# EAGLE design strip (EAGLE 6.2)

## Sheet 1 of 2
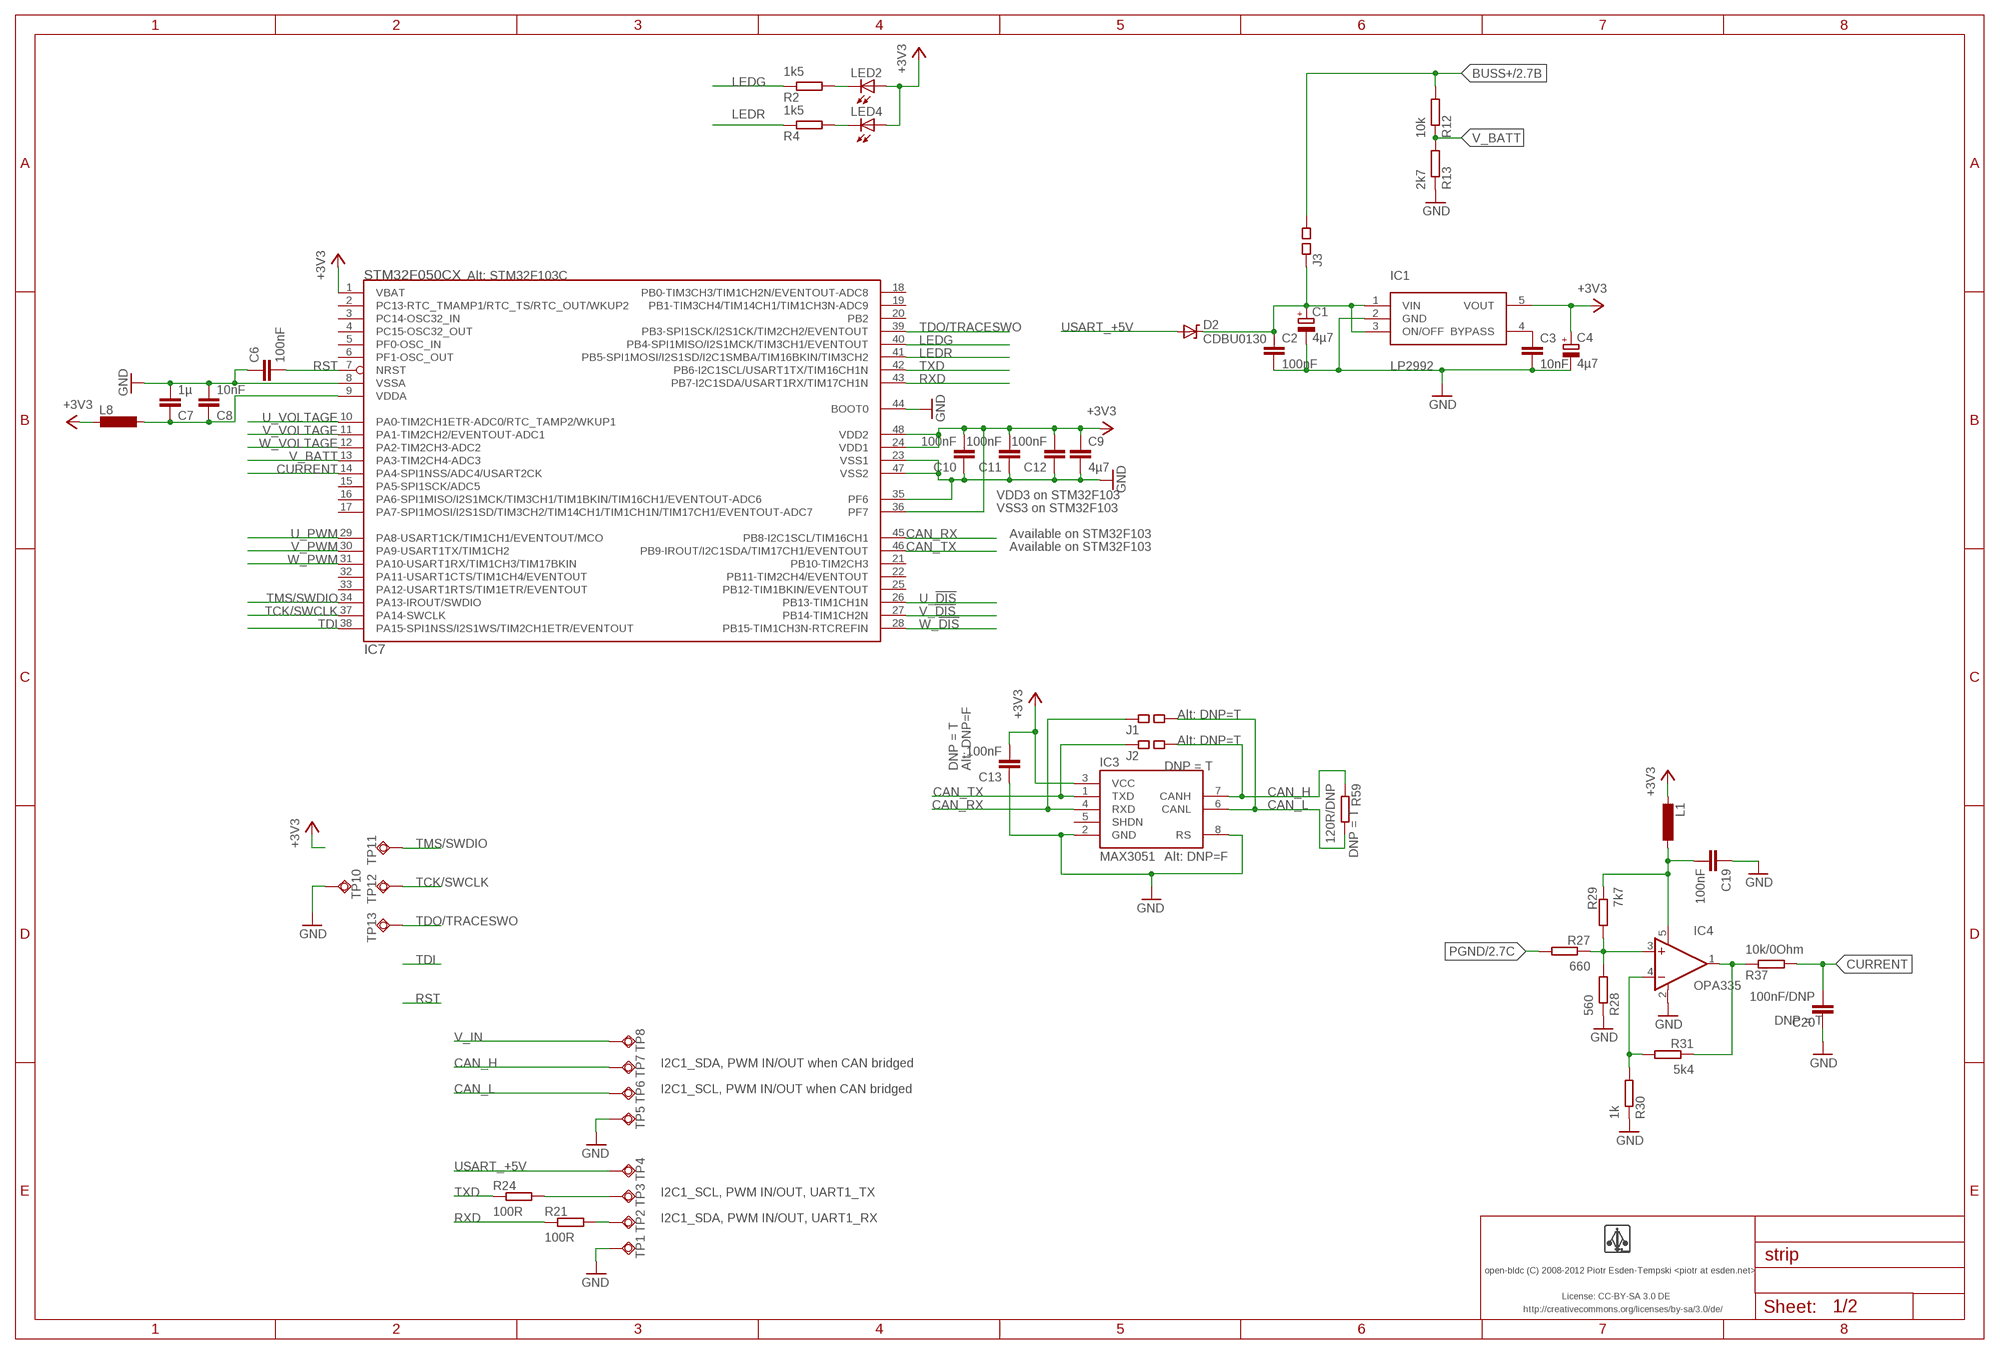
[diagram p0: schematic, sheet 1]

### Parts
C1  4µ7  CAPACITOR-POL-0805  [0805-POL-CAP]
C2  100nF  CAPACITOR-0402  [0402-CAP]
C3  10nF  CAPACITOR-0402  [0402-CAP]
C4  4µ7  CAPACITOR-POL-0805  [0805-POL-CAP]
C6  100nF  CAPACITOR-0402  [0402-CAP]
C7  1µ  CAPACITOR-0402  [0402-CAP]
C8  10nF  CAPACITOR-0402  [0402-CAP]
C9  4µ7  CAPACITOR-0805  [0805-CAP]
C10  100nF  CAPACITOR-0402  [0402-CAP]
C11  100nF  CAPACITOR-0402  [0402-CAP]
C12  100nF  CAPACITOR-0402  [0402-CAP]
C13  100nF  CAPACITOR-0402  [0402-CAP]
C19  100nF  CAPACITOR-0402  [0402-CAP]
C20  100nF/DNP  CAPACITOR-0402  [0402-CAP]
D2  CDBU0130  DIODE-ZENER-0603  [0603-DIO]
IC1  LP2992  [SOT23-5]
IC3  MAX3051  [SO8]
IC4  OPA335  [SOT23-5]
IC7  STM32F050CX  [LQFP48]
J1  SQ_JMP-0402  [0402-SQJMP]
J2  SQ_JMP-0402  [0402-SQJMP]
J3  SQ_JMP-0402  [0402-SQJMP]
L1  INDUCTOR-0603  [0603-IND]
L8  INDUCTOR-0603  [0603-IND]
LED2  GREEN  LED-0402  [0402-LED]
LED4  RED  LED-0402  [0402-LED]
R2  1k5  RESISTOR-0402  [0402-RES]
R4  1k5  RESISTOR-0402  [0402-RES]
R12  10k  RESISTOR-0402  [0402-RES]
R13  2k7  RESISTOR-0402  [0402-RES]
R21  100R  RESISTOR-0402  [0402-RES]
R24  100R  RESISTOR-0402  [0402-RES]
R27  660  RESISTOR-0402  [0402-RES]
R28  560  RESISTOR-0402  [0402-RES]
R29  7k7  RESISTOR-0402  [0402-RES]
R30  1k  RESISTOR-0402  [0402-RES]
R31  5k4  RESISTOR-0402  [0402-RES]
R37  10k/0Ohm  RESISTOR-0402  [0402-RES]
R59  120R/DNP  RESISTOR-0402  [0402-RES]
TP1  TPSQTP20SQ  [TP20SQ]
TP2  TPSQTP20SQ  [TP20SQ]
TP3  TPSQTP20SQ  [TP20SQ]
TP4  TPSQTP20SQ  [TP20SQ]
TP5  TPSQTP20SQ  [TP20SQ]
TP6  TPSQTP20SQ  [TP20SQ]
TP7  TPSQTP20SQ  [TP20SQ]
TP8  TPSQTP20SQ  [TP20SQ]
TP10  TPSQTP11SQ  [TP11SQ]
TP11  TPSQTP11SQ  [TP11SQ]
TP12  TPSQTP11SQ  [TP11SQ]
TP13  TPSQTP11SQ  [TP11SQ]
U$1  LOGO  LOGO-SILK-SMALL  [LOGO_SILK_SMALL]

### Nets
+3V3: C4.+ C9.P$1 C10.P$2 C11.P$2 C12.P$2 C13.P$2 IC1.5(VOUT) IC3.3(VCC) IC7.1(VBAT) IC7.24(VDD1) IC7.36(PF7) IC7.48(VDD2) L1.P$2 L8.P$2 LED2.A LED4.A
BUSS+: J3.P$2 R12.P$2 ; also sheet 2
CAN_H: IC3.7(CANH) J2.P$2 R59.P$1 TP7.TP
CAN_L: IC3.6(CANL) J1.P$2 R59.P$2 TP6.TP
CAN_RX: IC3.4(RXD) IC7.45(PB8-I2C1SCL/TIM16CH1) J1.P$1
CAN_TX: IC3.1(TXD) IC7.46(PB9-IROUT/I2C1SDA/TIM17CH1/EVENTOUT) J2.P$1
CURRENT: C20.P$2 IC7.14(PA4-SPI1NSS/ADC4/USART2CK) R37.P$2
CURRENT_RAW: IC4.1(OUT) R31.P$1 R37.P$1
GND: C1.- C2.P$2 C3.P$2 C4.- C6.P$1 C7.P$2 C8.P$2 C9.P$2 C10.P$1 C11.P$1 C12.P$1 C13.P$1 C19.P$1 C20.P$1 IC1.2(GND) IC3.2(GND) IC3.8(RS) IC4.2(V-) IC7.8(VSSA) IC7.23(VSS1) IC7.35(PF6) IC7.44(BOOT0) IC7.47(VSS2) R13.P$1 R28.P$1 R30.P$1 TP1.TP TP5.TP TP10.TP ; also sheet 2
LEDG: IC7.40(PB4-SPI1MISO/I2S1MCK/TIM3CH1/EVENTOUT) R2.P$1
LEDR: IC7.41(PB5-SPI1MOSI/I2S1SD/I2C1SMBA/TIM16BKIN/TIM3CH2) R4.P$1
N$4: LED4.C R4.P$2
N$6: R21.P$2 TP2.TP
N$9: C19.P$2 IC4.5(V+) L1.P$1 R29.P$1
N$10: LED2.C R2.P$2
N$11: IC4.3(+IN) R27.P$1 R28.P$2 R29.P$2
N$12: IC4.4(-IN) R30.P$2 R31.P$2
N$20: R24.P$2 TP3.TP
N$22: C3.P$1 IC1.4(BYPASS)
PGND: R27.P$2 ; also sheet 2
RST: C6.P$2 IC7.7(NRST)
RXD: IC7.43(PB7-I2C1SDA/USART1RX/TIM17CH1N) R21.P$1
TCK/SWCLK: IC7.37(PA14-SWCLK) TP12.TP
TDI: IC7.38(PA15-SPI1NSS/I2S1WS/TIM2CH1ETR/EVENTOUT)
TDO/TRACESWO: IC7.39(PB3-SPI1SCK/I2S1CK/TIM2CH2/EVENTOUT) TP13.TP
TMS/SWDIO: IC7.34(PA13-IROUT/SWDIO) TP11.TP
TXD: IC7.42(PB6-I2C1SCL/USART1TX/TIM16CH1N) R24.P$1
U_!DIS: IC7.26(PB13-TIM1CH1N) ; also sheet 2
U_PWM: IC7.29(PA8-USART1CK/TIM1CH1/EVENTOUT/MCO) ; also sheet 2
U_VOLTAGE: IC7.10(PA0-TIM2CH1ETR-ADC0/RTC_TAMP2/WKUP1) ; also sheet 2
USART_+5V: D2.A TP4.TP
V_!DIS: IC7.27(PB14-TIM1CH2N) ; also sheet 2
V_BATT: IC7.13(PA3-TIM2CH4-ADC3) R12.P$1 R13.P$2
V_IN: C1.+ C2.P$1 D2.C IC1.1(VIN) IC1.3(ON/OFF) J3.P$1 TP8.TP
V_PWM: IC7.30(PA9-USART1TX/TIM1CH2) ; also sheet 2
V_VOLTAGE: IC7.11(PA1-TIM2CH2/EVENTOUT-ADC1) ; also sheet 2
VDDA: C7.P$1 C8.P$1 IC7.9(VDDA) L8.P$1
W_!DIS: IC7.28(PB15-TIM1CH3N-RTCREFIN) ; also sheet 2
W_PWM: IC7.31(PA10-USART1RX/TIM1CH3/TIM17BKIN) ; also sheet 2
W_VOLTAGE: IC7.12(PA2-TIM2CH3-ADC2) ; also sheet 2
Unconnected: IC3.5(SHDN) IC7.2(PC13-RTC_TMAMP1/RTC_TS/RTC_OUT/WKUP2) IC7.3(PC14-OSC32_IN) IC7.4(PC15-OSC32_OUT) IC7.5(PF0-OSC_IN) IC7.6(PF1-OSC_OUT) IC7.15(PA5-SPI1SCK/ADC5) IC7.16(PA6-SPI1MISO/I2S1MCK/TIM3CH1/TIM1BKIN/TIM16CH1/EVENTOUT-ADC6) IC7.17(PA7-SPI1MOSI/I2S1SD/TIM3CH2/TIM14CH1/TIM1CH1N/TIM17CH1/EVENTOUT-ADC7) IC7.18(PB0-TIM3CH3/TIM1CH2N/EVENTOUT-ADC8) IC7.19(PB1-TIM3CH4/TIM14CH1/TIM1CH3N-ADC9) IC7.20(PB2) IC7.21(PB10-TIM2CH3) IC7.22(PB11-TIM2CH4/EVENTOUT) IC7.25(PB12-TIM1BKIN/EVENTOUT) IC7.32(PA11-USART1CTS/TIM1CH4/EVENTOUT) IC7.33(PA12-USART1RTS/TIM1ETR/EVENTOUT)

### Notes on the sheet
- Alt: STM32F103C
- VDD3 on STM32F103
- VSS3 on STM32F103
- Available on STM32F103
- Available on STM32F103
- Alt: DNP=T
- Alt: DNP=T
- Alt: DNP=F
- Alt: DNP=F
- I2C1_SDA, PWM IN/OUT when CAN bridged
- I2C1_SCL, PWM IN/OUT when CAN bridged
- I2C1_SCL, PWM IN/OUT, UART1_TX
- I2C1_SDA, PWM IN/OUT, UART1_RX
- open-bldc (C) 2008-2012 Piotr Esden-Tempski <piotr at esden.net>
- License: CC-BY-SA 3.0 DE
- http://creativecommons.org/licenses/by-sa/3.0/de/

## Sheet 2 of 2
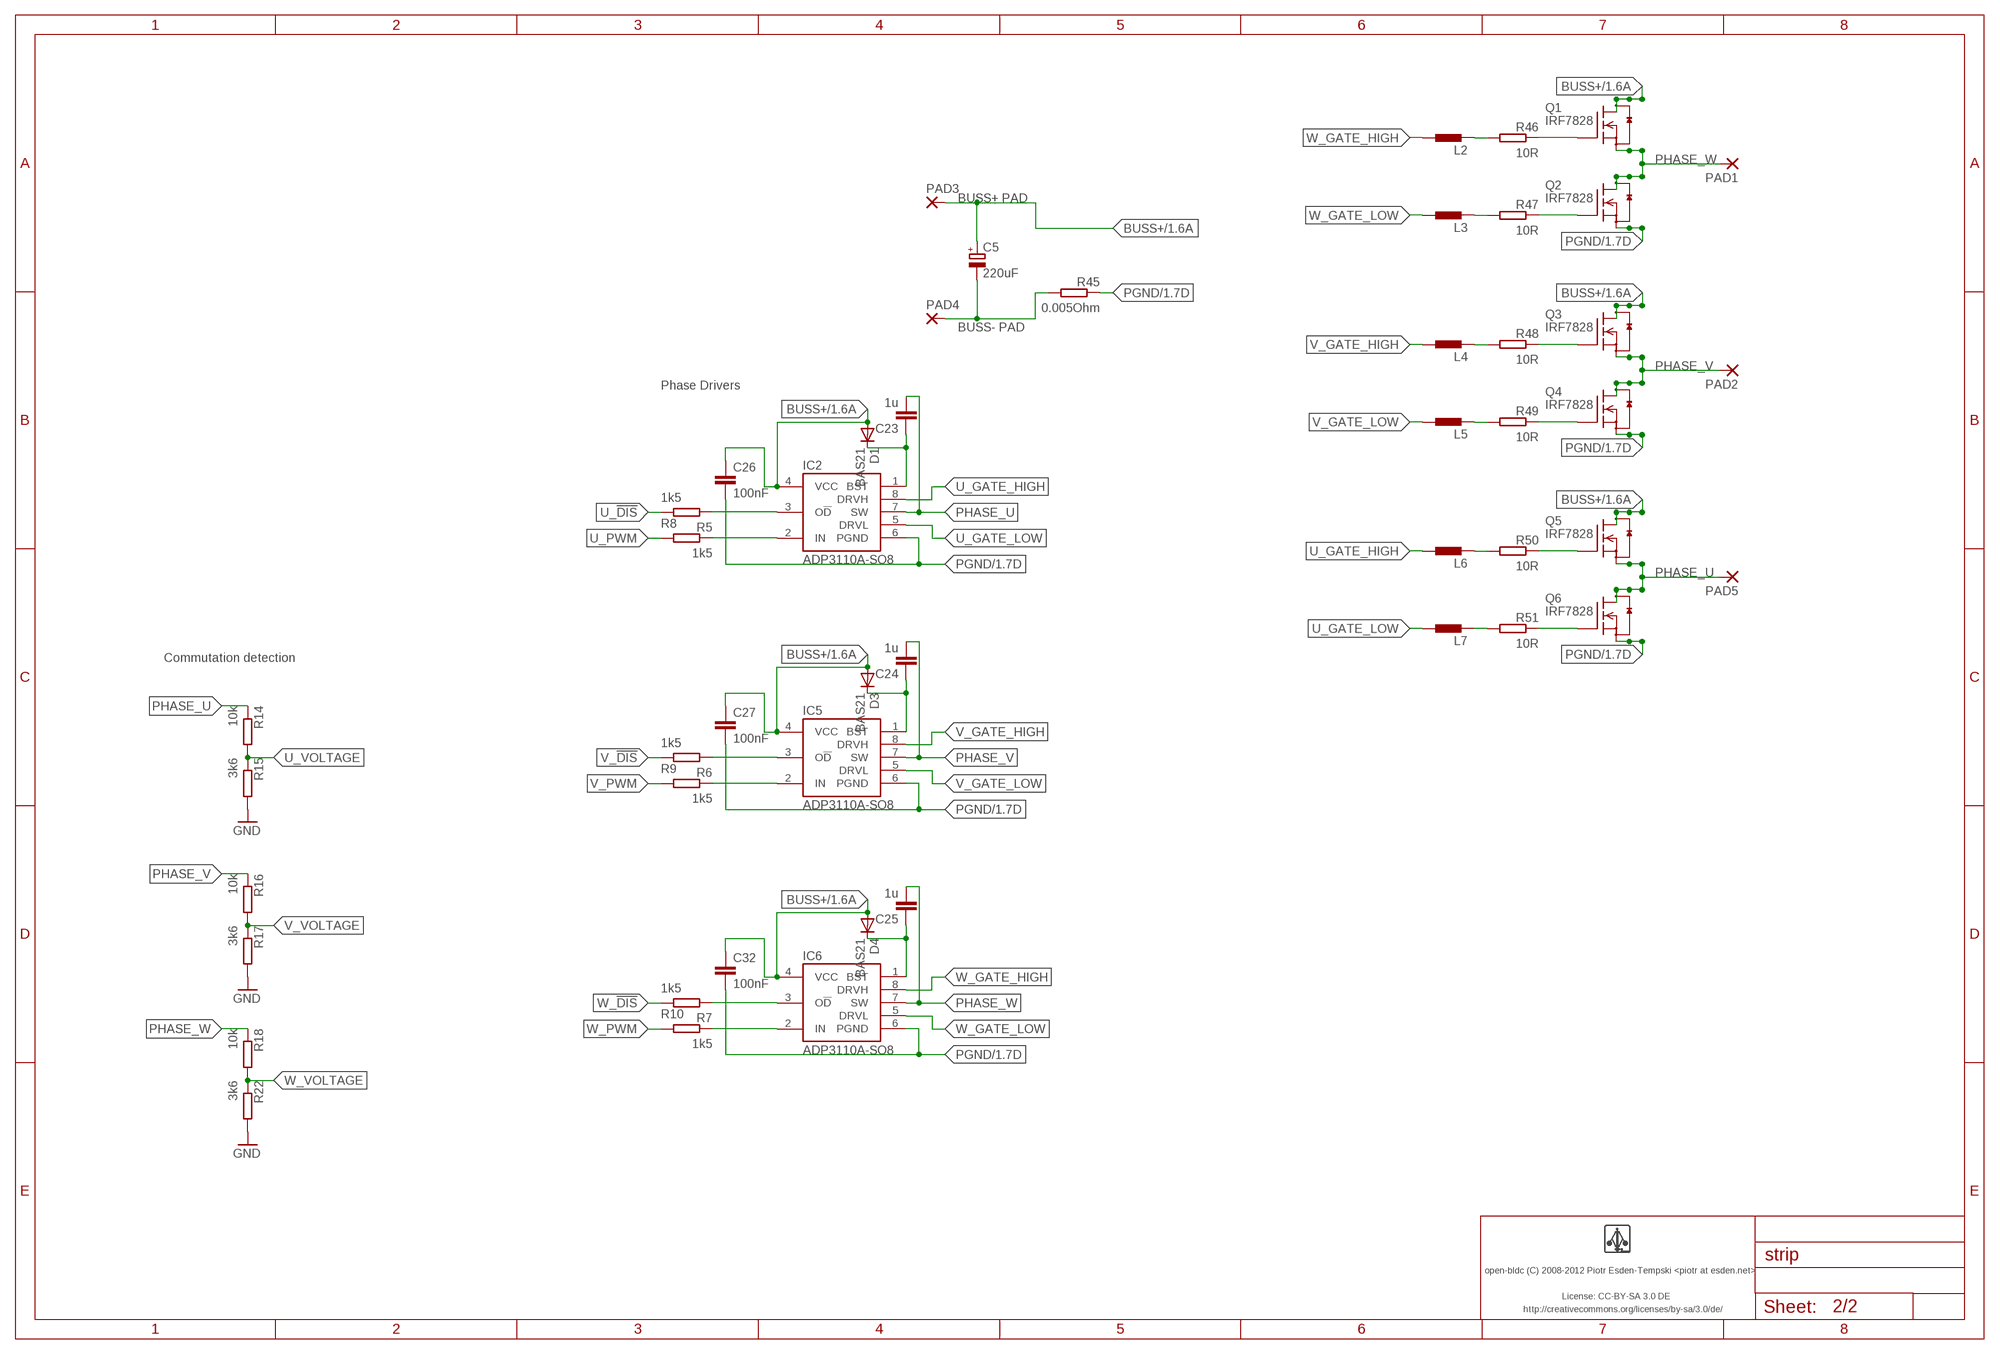
[diagram p1: schematic, sheet 2]

### Parts
C5  220uF  CAPACITOR-POLD  [7343/D]
C23  1u  CAPACITOR-0603  [0603-CAP]
C24  1u  CAPACITOR-0603  [0603-CAP]
C25  1u  CAPACITOR-0603  [0603-CAP]
C26  100nF  CAPACITOR-0402  [0402-CAP]
C27  100nF  CAPACITOR-0402  [0402-CAP]
C32  100nF  CAPACITOR-0402  [0402-CAP]
D1  BAS21  DIODE-SOD-123  [SOD-123-DIO]
D3  BAS21  DIODE-SOD-123  [SOD-123-DIO]
D4  BAS21  DIODE-SOD-123  [SOD-123-DIO]
IC2  ADP3110A-SO8  [SO8]
IC5  ADP3110A-SO8  [SO8]
IC6  ADP3110A-SO8  [SO8]
L2  INDUCTOR-0402  [0402-IND]
L3  INDUCTOR-0402  [0402-IND]
L4  INDUCTOR-0402  [0402-IND]
L5  INDUCTOR-0402  [0402-IND]
L6  INDUCTOR-0402  [0402-IND]
L7  INDUCTOR-0402  [0402-IND]
PAD1  SMD5  [SMD2,54-5,08]
PAD2  SMD5  [SMD2,54-5,08]
PAD3  SMD5  [SMD2,54-5,08]
PAD4  SMD5  [SMD2,54-5,08]
PAD5  SMD5  [SMD2,54-5,08]
Q1  IRF7828  [SO8]
Q2  IRF7828  [SO8]
Q3  IRF7828  [SO8]
Q4  IRF7828  [SO8]
Q5  IRF7828  [SO8]
Q6  IRF7828  [SO8]
R5  1k5  RESISTOR-0402  [0402-RES]
R6  1k5  RESISTOR-0402  [0402-RES]
R7  1k5  RESISTOR-0402  [0402-RES]
R8  1k5  RESISTOR-0402  [0402-RES]
R9  1k5  RESISTOR-0402  [0402-RES]
R10  1k5  RESISTOR-0402  [0402-RES]
R14  10k  RESISTOR-0402  [0402-RES]
R15  3k6  RESISTOR-0402  [0402-RES]
R16  10k  RESISTOR-0402  [0402-RES]
R17  3k6  RESISTOR-0402  [0402-RES]
R18  10k  RESISTOR-0402  [0402-RES]
R22  3k6  RESISTOR-0402  [0402-RES]
R45  0.005Ohm  RESISTOR-1206  [1206-RES]
R46  10R  RESISTOR-0402  [0402-RES]
R47  10R  RESISTOR-0402  [0402-RES]
R48  10R  RESISTOR-0402  [0402-RES]
R49  10R  RESISTOR-0402  [0402-RES]
R50  10R  RESISTOR-0402  [0402-RES]
R51  10R  RESISTOR-0402  [0402-RES]
U$2  LOGO  LOGO-SILK-SMALL  [LOGO_SILK_SMALL]

### Nets
BUSS+: C5.+ C26.P$1 C27.P$1 C32.P$1 D1.A D3.A D4.A IC2.4(VCC) IC5.4(VCC) IC6.4(VCC) PAD3.1(P) Q1.5(D1) Q1.6(D2) Q1.7(D3) Q1.8(D4) Q3.5(D1) Q3.6(D2) Q3.7(D3) Q3.8(D4) Q5.5(D1) Q5.6(D2) Q5.7(D3) Q5.8(D4) ; also sheet 1
GND: C5.- PAD4.1(P) R15.P$2 R17.P$2 R22.P$2 R45.P$2 ; also sheet 1
N$2: C23.P$1 D1.C IC2.1(BST)
N$7: C24.P$1 D3.C IC5.1(BST)
N$8: C25.P$1 D4.C IC6.1(BST)
N$23: L2.P$2 R46.P$2
N$24: L3.P$2 R47.P$2
N$25: L4.P$2 R48.P$2
N$26: L5.P$2 R49.P$2
N$27: L6.P$2 R50.P$2
N$28: L7.P$2 R51.P$2
N$29: Q1.4(G) R46.P$1
N$30: Q2.4(G) R47.P$1
N$31: Q3.4(G) R48.P$1
N$32: Q4.4(G) R49.P$1
N$34: Q5.4(G) R50.P$1
N$35: Q6.4(G) R51.P$1
PGND: C26.P$2 C27.P$2 C32.P$2 IC2.6(PGND) IC5.6(PGND) IC6.6(PGND) Q2.1(S3) Q2.2(S2) Q2.3(S1) Q4.1(S3) Q4.2(S2) Q4.3(S1) Q6.1(S3) Q6.2(S2) Q6.3(S1) R45.P$1 ; also sheet 1
PHASE_U: C23.P$2 IC2.7(SW) PAD5.1(P) Q5.1(S3) Q5.2(S2) Q5.3(S1) Q6.5(D1) Q6.6(D2) Q6.7(D3) Q6.8(D4) R14.P$1
PHASE_V: C24.P$2 IC5.7(SW) PAD2.1(P) Q3.1(S3) Q3.2(S2) Q3.3(S1) Q4.5(D1) Q4.6(D2) Q4.7(D3) Q4.8(D4) R16.P$1
PHASE_W: C25.P$2 IC6.7(SW) PAD1.1(P) Q1.1(S3) Q1.2(S2) Q1.3(S1) Q2.5(D1) Q2.6(D2) Q2.7(D3) Q2.8(D4) R18.P$1
U_!DIS: R8.P$1 ; also sheet 1
U_!DIS!1: IC2.3(O!D) R8.P$2
U_GATE_HIGH: IC2.8(DRVH) L6.P$1
U_GATE_LOW: IC2.5(DRVL) L7.P$1
U_PWM: R5.P$2 ; also sheet 1
U_PWM1: IC2.2(IN) R5.P$1
U_VOLTAGE: R14.P$2 R15.P$1 ; also sheet 1
V_!DIS: R9.P$1 ; also sheet 1
V_!DIS!1: IC5.3(O!D) R9.P$2
V_GATE_HIGH: IC5.8(DRVH) L4.P$1
V_GATE_LOW: IC5.5(DRVL) L5.P$1
V_PWM: R6.P$2 ; also sheet 1
V_PWM1: IC5.2(IN) R6.P$1
V_VOLTAGE: R16.P$2 R17.P$1 ; also sheet 1
W_!DIS: R10.P$1 ; also sheet 1
W_!DIS1: IC6.3(O!D) R10.P$2
W_GATE_HIGH: IC6.8(DRVH) L2.P$1
W_GATE_LOW: IC6.5(DRVL) L3.P$1
W_PWM: R7.P$2 ; also sheet 1
W_PWM1: IC6.2(IN) R7.P$1
W_VOLTAGE: R18.P$2 R22.P$1 ; also sheet 1

### Notes on the sheet
- BUSS+ PAD
- BUSS- PAD
- Phase Drivers
- Commutation detection
- open-bldc (C) 2008-2012 Piotr Esden-Tempski <piotr at esden.net>
- License: CC-BY-SA 3.0 DE
- http://creativecommons.org/licenses/by-sa/3.0/de/

## Library data of the parts
C1 C4 = pel_dipol_comp:CAPACITOR-POL; PARTNO: cap-cer-0805-4u7-16v
C2 C6 C10-C12 C19 C26 C27 C32 = pel_dipol_comp:CAPACITOR; PARTNO: cap-cer-0402-100n
C3 C8 = pel_dipol_comp:CAPACITOR; PARTNO: cap-cer-0402-10n
C5 = pel_dipol_comp:CAPACITOR-POL; PARTNO: cap-tan-D-220u-16v
C7 = pel_dipol_comp:CAPACITOR; PARTNO: cap-cer-0402-1u
C9 = pel_dipol_comp:CAPACITOR; PARTNO: cap-cer-0805-4u7
C13 C20 = pel_dipol_comp:CAPACITOR; DNP: T; PARTNO: cap-cer-0402-100n
C23-C25 = pel_dipol_comp:CAPACITOR; PARTNO: cap-tan-0603-1u
D1 D3 D4 = pel_dipol_comp:DIODE; PARTNO: diode-sod-123
D2 = pel_dipol_comp:DIODE-ZENER; PARTNO: diode-0603
IC1 = open-bldc:LP2992; PARTNO: vreg-sot-23-5-3v3
IC2 IC5 IC6 = open-bldc:ADP3110A; PARTNO: ic-so8-mosfet-driver-buck
IC3 = open-bldc:MAX3051; DNP: T; PARTNO: ic-so8-can-3v3
IC4 = open-bldc:OPA335; PARTNO: ic-sot-23-5-opamp
IC7 = pel_stm32:STM32F050CX; PARTNO: mcu-lqfp-48-stm32f05
J1-J3 = pel_jumpers:SQ_JMP; PARTNO: res-0402-0
L1 L8 = res_cap:INDUCTOR; PARTNO: ferrite-0603-600ohm
L2-L7 = pel_dipol_comp:INDUCTOR; PARTNO: res-0402-0
LED2 LED4 = pel_dipol_comp:LED; PARTNO: led-0402-green
PAD1-PAD5 = wirepad:SMD5: SMD PAD; PARTNO: *
Q1-Q6 = open-bldc:IRF7828; PARTNO: ic-so8-mosfet-n-ch-30v-15a
R2 R4-R10 = pel_dipol_comp:RESISTOR; PARTNO: res-0402-1k5
R12 R14 R16 R18 = pel_dipol_comp:RESISTOR; PARTNO: res-0402-10k
R13 = pel_dipol_comp:RESISTOR; PARTNO: res-0402-2k7
R15 R17 R22 = pel_dipol_comp:RESISTOR; PARTNO: res-0402-3k6
R21 R24 = pel_dipol_comp:RESISTOR; PARTNO: res-0402-100
R27 = pel_dipol_comp:RESISTOR; PARTNO: res-0402-665
R28 = pel_dipol_comp:RESISTOR; PARTNO: res-0402-560
R29 = pel_dipol_comp:RESISTOR; PARTNO: res-0402-7k68
R30 = pel_dipol_comp:RESISTOR; PARTNO: res-0402-1k
R31 = pel_dipol_comp:RESISTOR; PARTNO: res-0402-5k36
R37 = pel_dipol_comp:RESISTOR; PARTNO: res-0402-0
R45 = pel_dipol_comp:RESISTOR; PARTNO: res-1206-0005
R46-R51 = pel_dipol_comp:RESISTOR; PARTNO: res-0402-10
R59 = pel_dipol_comp:RESISTOR; DNP: T; PARTNO: res-0402-60.4
TP1-TP8 TP10-TP13 = testpad:TPSQ: Test pad; DNP: T; PARTNO: *
U$1 U$2 = open-bldc:LOGO; PARTNO: *

## Board
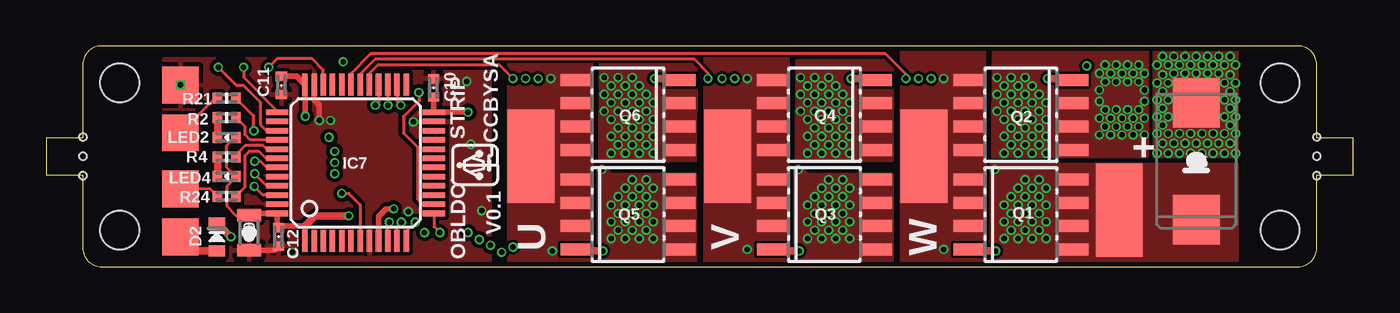
[diagram p2: board, top side]
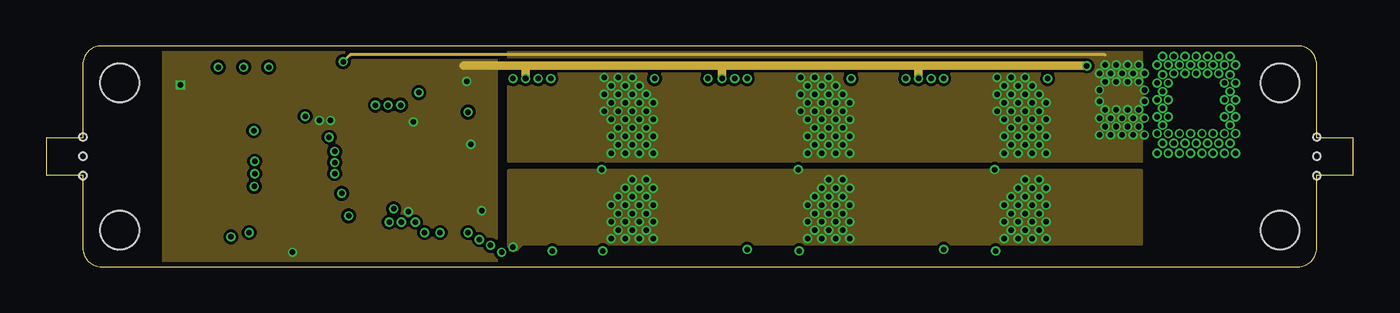
[diagram p3: board, inner layer Route2]
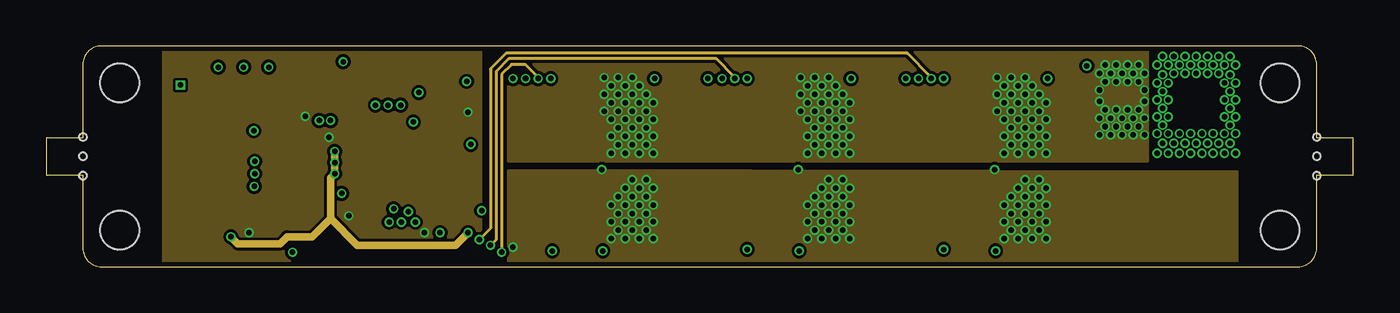
[diagram p4: board, inner layer Route15]
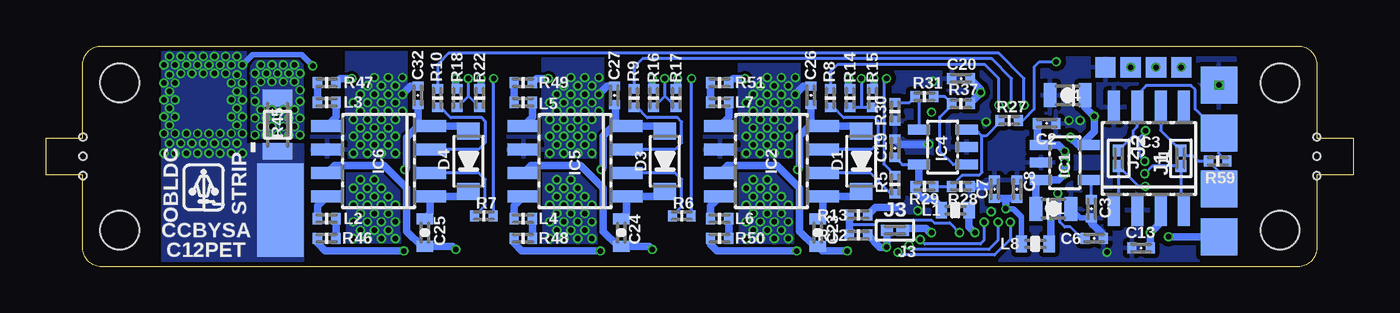
[diagram p5: board, bottom side, seen from below]

Size 71 x 12 mm. Coordinates in mm from the lower left corner, seen from the top.
Outline: 2,1 arc90 3,0 68,0 arc90 69,1 69,5 71,5 71,7 69,7 69,11 arc90 68,12 3,12 arc90 2,11 2,7 0,7 0,5 2,5 2,1
Copper layers (1*2+15*16): Top 0.035mm / dielectric 0.75mm / Route2 0.035mm / dielectric 0.15mm / Route15 0.035mm / dielectric 0.75mm / Bottom 0.035mm
Design rules: minimum track width 6mil, minimum drill 0.3mm, track to track 6mil, track to pad 6mil, pad to pad 6mil, via to via 6mil, smd to smd 6mil, copper to edge 10mil, drill to drill 8mil, minimum pad ring 0.1mm, minimum via ring 0.1mm, stop-mask expansion 4mil, vias tented up to drill 0.4mm, thermal gap 10mil
Holes 2.1 mm at 67,2 4,10 67,10 4,2
Holes 0.4 mm at 69,6 69,7.05 69,4.95 2,4.95 2,6 2,7.05
bRestrict: area 29.6,21.1 to 29.9,21.1; area 25.8,21 to 26.1,21

### Footprints (pad centres in the part's own frame; a part is rotated, then mirrored left to right if it is on the bottom)
0805-POL-CAP = smd 0.7 x 1.3: + -0.95,0; - 0.95,0
0402-CAP = smd 0.5 x 0.6: P$1 -0.5,0; P$2 0.5,0
7343/D = smd 2.7 x 2.55: + -3.175,0; - 3.175,0
0805-CAP = smd 0.7 x 1.3: P$1 -0.95,0; P$2 0.95,0
0603-CAP = smd 0.6 x 0.9: P$1 -0.75,0; P$2 0.75,0
SOD-123-DIO = smd 0.91 x 1.22: A 1.64,0; C -1.64,0
0603-DIO = smd 0.6 x 0.9: A 0.75,0; C -0.75,0
SOT23-5 = smd 0.55 x 1.2: 1 -0.95,-1.3; 2 0,-1.3; 3 0.95,-1.3; 4 0.95,1.3; 5 -0.95,1.3
SO8 = smd 0.65 x 1.75: 1 -1.905,-2.8; 2 -0.635,-2.8; 3 0.635,-2.8; 4 1.905,-2.8; 5 1.905,2.8; 6 0.635,2.8; 7 -0.635,2.8; 8 -1.905,2.8
LQFP48 = smd 0.3 x 1.2: 1 -2.75,-4.25; 2 -2.25,-4.25; 3 -1.75,-4.25; 4 -1.25,-4.25; 5 -0.75,-4.25; 6 -0.25,-4.25; 7 0.25,-4.25; 8 0.75,-4.25; 9 1.25,-4.25; 10 1.75,-4.25; 11 2.25,-4.25; 12 2.75,-4.25; 25 2.75,4.25; 26 2.25,4.25; 27 1.75,4.25; 28 1.25,4.25; 29 0.75,4.25; 30 0.25,4.25; 31 -0.25,4.25; 32 -0.75,4.25; 33 -1.25,4.25; 34 -1.75,4.25; 35 -2.25,4.25; 36 -2.75,4.25 | smd 1.2 x 0.3: 13 4.25,-2.75; 14 4.25,-2.25; 15 4.25,-1.75; 16 4.25,-1.25; 17 4.25,-0.75; 18 4.25,-0.25; 19 4.25,0.25; 20 4.25,0.75; 21 4.25,1.25; 22 4.25,1.75; 23 4.25,2.25; 24 4.25,2.75; 37 -4.25,2.75; 38 -4.25,2.25; 39 -4.25,1.75; 40 -4.25,1.25; 41 -4.25,0.75; 42 -4.25,0.25; 43 -4.25,-0.25; 44 -4.25,-0.75; 45 -4.25,-1.25; 46 -4.25,-1.75; 47 -4.25,-2.25; 48 -4.25,-2.75
0402-SQJMP = smd 0.652 x 0.6: P$1 -0.424,0; P$2 0.424,0
0603-IND = smd 0.6 x 0.9: P$1 -0.75,0; P$2 0.75,0
0402-IND = smd 0.5 x 0.6: P$1 -0.5,0; P$2 0.5,0
0402-LED = smd 0.5 x 0.6: A 0.5,0; C -0.5,0
SMD2,54-5,08 = smd 2.54 x 5.08: 1 0,0
0402-RES = smd 0.5 x 0.6: P$1 -0.5,0; P$2 0.5,0
1206-RES = smd 0.9 x 1.6: P$1 -1.45,0; P$2 1.45,0
TP20SQ = smd 2 x 2: TP 0,0
TP11SQ = smd 1.1 x 1.1: TP 0,0

### Placement (x,y rotation side)
C1  16.29,3.15 0 bottom
C2  16.67,7.79 0 bottom
C3  14.23,3.15 270 bottom
C4  15.53,9.32 180 bottom
C5  62.46,5.74 90 top
C6  14.08,1.55 180 bottom
C7  19.49,4.21 90 bottom
C8  18.27,4.21 90 bottom
C9  11.03,1.85 270 top
C10  21.04,9.72 270 top
C11  12.78,9.85 90 top
C12  12.63,1.62 90 top
C13  11.54,1.01 0 bottom
C19  24.9,6.45 270 bottom
C20  21.32,10.23 0 bottom
C23  29.09,1.85 270 bottom
C24  39.76,1.85 270 bottom
C25  50.42,1.85 270 bottom
C26  29.47,9.32 90 bottom
C27  40.14,9.32 90 bottom
C32  50.81,9.32 90 bottom
D1  26.73,5.74 90 bottom
D2  9.28,1.62 270 top
D3  37.39,5.74 90 bottom
D4  48.06,5.74 90 bottom
IC1  15.68,5.66 270 bottom
IC2  31.6,5.74 90 bottom
IC3  11.11,5.89 0 bottom
IC4  22.31,6.5 90 bottom
IC5  42.27,5.74 90 bottom
IC6  52.94,5.74 90 bottom
IC7  16.81,5.65 0 top
J1  9.38,5.89 90 bottom
J2  12.76,5.89 90 bottom
J3  24.9,1.98 180 bottom
L1  21.62,3.07 0 bottom
L2  55.76,2.61 0 bottom
L3  55.76,8.94 180 bottom
L4  45.09,2.61 0 bottom
L5  45.09,8.94 180 bottom
L6  34.42,2.61 0 bottom
L7  34.42,8.94 180 bottom
L8  17.28,1.24 0 bottom
LED2  9.81,7.03 0 top
LED4  9.81,4.9 0 top
PAD1  47.68,6 180 top
PAD2  37.01,6 180 top
PAD3  58.27,3.07 180 top
PAD4  58.27,3.07 0 bottom
PAD5  26.35,6 180 top
Q1  52.94,2.84 270 top
Q2  52.94,8.25 90 top
Q3  42.27,2.84 270 top
Q4  42.27,8.25 90 top
Q5  31.6,2.84 270 top
Q6  31.6,8.25 90 top
R2  9.81,8.1 180 top
R4  9.81,5.96 180 top
R5  24.9,4.47 90 bottom
R6  36.48,2.76 0 bottom
R7  47.22,2.76 0 bottom
R8  28.4,9.17 270 bottom
R9  39.07,9.17 270 bottom
R10  49.74,9.17 270 bottom
R12  26.88,1.72 0 bottom
R13  26.88,2.82 180 bottom
R14  27.34,9.17 270 bottom
R15  26.12,9.17 90 bottom
R16  38,9.17 270 bottom
R17  36.78,9.17 90 bottom
R18  48.67,9.17 270 bottom
R21  9.81,9.17 180 top
R22  47.45,9.17 90 bottom
R24  9.81,3.83 180 top
R27  18.7,7.95 0 bottom
R28  21.32,4.36 180 bottom
R29  23.3,4.36 0 bottom
R30  24.9,8.43 90 bottom
R31  23.3,9.24 180 bottom
R37  21.32,8.86 0 bottom
R45  58.43,7.72 270 bottom
R46  55.76,1.55 0 bottom
R47  55.76,10 180 bottom
R48  45.09,1.55 0 bottom
R49  45.09,10 180 bottom
R50  34.42,1.55 0 bottom
R51  34.42,10 180 bottom
R59  7.37,5.74 180 bottom
TP1  7.3,9.88 0 top
TP2  7.3,7.28 0 top
TP3  7.3,4.22 0 top
TP4  7.3,1.62 0 top
TP5  7.3,9.88 0 bottom
TP6  7.3,4.23 0 bottom
TP7  7.3,7.27 0 bottom
TP8  7.3,1.62 0 bottom
TP10  13.47,10.84 0 bottom
TP11  12.1,10.84 0 bottom
TP12  10.72,10.84 0 bottom
TP13  9.35,10.84 0 bottom
U$1  62.44,4.47 0 bottom
U$2  23.14,5.52 90 top

### Tracks (layer width: path | path; a pad name or v marks a point on that pad's centre or on a via)
+3V3  (via drill 0.3)
  Top 0.152: LED2.A 10.27,7.03 9.81,6.58 9.81,5.4 LED4.A 10.31,4.87 9.81,4.37 9.81,3.3 10.31,2.8 C9.P$1
  Top 0.305: C11.P$2 13.61,10.35 IC7.36 14.06,8.19 v14.08,8.18 | C10.P$2 21.04,8.42 IC7.24 v22.91,8.4 v22.92,8.4 | IC7.1 14.06,2.21 12.72,2.21 C12.P$2 12.56,2.19 IC7.48 11.13,2.9 C9.P$1
  Top 0.406: 14.06,2.21 14.61,2.77 v16.44,2.77
  Bottom 0.406: 14.57,9.28 C4.+ 14.57,8.67 v14.08,8.18 14.08,7.34 14.84,6.58 | IC1.5 14.95,6.61 v15.37,7.03 | L8.P$2 16.44,1.33 v16.44,2.77 | IC3.3 10.47,2.41 v11.03,1.85 v11.04,1.84 C13.P$2 | L1.P$2 20.87,2.17 v20.55,1.85
  pour Route15: 6.38,11.93 23.6,11.93 23.6,0.25 6.38,0.25
BUSS+  (via drill 0.3)
  Bottom 0.406: D3.A 37.66,7.64 IC5.4 40.06,7.64 | D1.A 26.99,7.64 IC2.4 29.39,7.64 | D4.A 48.33,7.64 IC6.4 50.81,7.64 | 29.39,7.64 29.55,7.64 30.08,7.11 30.08,5.38 v30.18,5.28 | 40.06,7.64 40.21,7.64 40.75,7.11 40.75,5.38 v40.85,5.28 | 50.81,7.64 51.41,7.03 51.41,5.38 v51.52,5.28 | C26.P$1 29.47,7.72 29.39,7.64 | C27.P$1 40.06,8.74 40.06,7.64 | C32.P$1 50.81,7.64 | J3.P$2 25.33,1.09 v25.36,1.06 25.72,1.06 R12.P$2
  other vias: 32.97,3.35 31.45,2.44 30.69,2.44 32.21,4.27 31.83,3.81 31.07,2.9 31.07,1.98 32.97,4.27 32.59,2.9 32.21,2.44 31.83,1.98 32.59,3.81 31.45,3.35 32.97,2.44 32.59,1.98 30.69,1.52 31.45,1.52 32.21,1.52 32.97,1.52 32.21,3.35 31.07,3.81 31.83,2.9 30.69,3.35 43.64,3.35 42.12,2.44 41.36,2.44 42.12,4.27 42.5,3.81 42.5,2.9 41.74,1.98 42.88,4.27 42.88,3.35 42.88,2.44 42.5,1.98 43.26,3.81 42.12,3.35 43.64,2.44 43.26,1.98 41.36,1.52 42.12,1.52 42.88,1.52 43.64,1.52 43.26,2.9 41.74,3.81 41.74,2.9 41.36,3.35 53.93,2.9 52.79,2.44 52.02,2.44 53.55,4.27 53.55,3.35 53.17,2.9 52.41,1.98 53.17,3.81 52.41,2.9 53.55,2.44 53.17,1.98 54.31,4.27 54.31,3.35 54.31,2.44 53.93,1.98 52.02,1.52 52.79,1.52 53.55,1.52 54.31,1.52 52.79,3.35 53.93,3.81 52.02,3.35 52.41,3.81 52.79,4.27 53.17,4.72 53.93,4.72 43.64,4.27 43.26,4.72 42.5,4.72 31.45,4.27 31.83,4.72 32.59,4.72
  pour Route2: 25.13,5.26 59.49,5.26 59.49,1.22 25.89,1.22 25.58,0.91 25.13,0.91
  pour Top (no thermals): 30,5.43 30.31,5.43 30.69,5.05 35.26,5.05 35.26,0.02 30,0.02
  pour Route15: 25.13,5.26 64.67,5.18 64.67,-0.08 25.13,-0.08
  pour Top (no thermals): 40.67,5.43 40.98,5.43 41.36,5.05 45.93,5.05 45.93,0.02 40.67,0.02
  pour Top (no thermals): 51.34,5.58 64.67,5.58 64.67,0.02 51.34,0.02
  pour Bottom: 30.46,1.24 33.28,1.24 33.28,5.13 30.46,5.13
  pour Bottom: 41.13,1.24 43.95,1.24 43.95,5.13 41.13,5.13
  pour Bottom: 51.8,1.32 54.62,1.32 54.62,5.2 51.8,5.2
CAN_H
  Bottom 0.152: J2.P$2 11.94,7.12 11.94,7.41 11.74,7.62 IC3.7 11.74,9.37 11.26,9.85 8.82,9.85 8.59,9.62 8.59,8.56 TP7.TP 7.3,6.16 R59.P$1
CAN_L
  Bottom 0.152: IC3.6 10.47,7.41 J1.P$2 9.11,6.04 8.74,6.04 8.44,5.74 R59.P$2 7.3,5.16 TP6.TP
CAN_RX  (via drill 0.3)
  Top 0.152: IC7.45 11.99,4.4 v11.33,5.05
  Bottom 0.152: v11.33,5.05 10.92,5.46 J1.P$1 9.38,3.27 IC3.4
CAN_TX  (via drill 0.3)
  Top 0.152: IC7.46 11.78,3.9 v11.31,4.37
  Bottom 0.152: v11.31,4.37 11.66,4.37 J2.P$1 12.76,3.34 IC3.1
CURRENT  (via drill 0.3)
  Top 0.152: v20.25,9.47 20.25,9.01 19.41,8.18 19.41,7.26 20.17,6.5 20.17,3.68 20.46,3.4 IC7.14
  Bottom 0.406: R37.P$2 20.25,9.43 v20.25,9.47 20.25,9.66 C20.P$2
CURRENT_RAW
  Bottom 0.152: IC4.1 21.74,5.55 22.46,6.27 22.46,8.14 21.82,8.78 R37.P$1 22.2,9.24 R31.P$1
GND  (via drill 0.3)
  Top 0.305: IC7.35 14.56,9.06 14.84,8.78 v14.84,7.95 | C12.P$1 12.41,0.9 C9.P$2
  Route2 0.457: v56.52,10.92 47.38,10.92 | 47.38,10.92 36.71,10.92 | 36.71,10.92 26.04,10.92 | 26.04,10.92 22.69,10.92 | v47.38,10.23 47.38,10.92 | v36.71,10.23 36.71,10.92 | v26.04,10.23 26.04,10.92
  Bottom 0.152: PAD4.1 58.27,5.43
  Bottom 0.305: v56.52,10.92 57.13,11.53 59.78,11.53 v60.33,10.97 | C3.P$2 14.84,2.65 C1.-
  Bottom 0.406: R15.P$2 26.04,9.74 v26.04,10.23 | R17.P$2 36.71,9.74 v36.71,10.23 | R22.P$2 47.38,9.74 v47.38,10.23 | C7.P$2 19.84,4.37 R28.P$1 | C6.P$1 13.58,1.73 14.23,2.38 C3.P$2 | C19.P$1 24.6,6.65 v23.07,6.65 | R13.P$1 25.97,3.22 24.82,3.22
  other vias: 7.3,9.88 13.39,0.78 23.65,3.04 19.94,7.87 22.84,10.08 15.45,7.95 19.68,2.99 60.94,6.17 61.55,6.17 60.33,6.17 62.16,6.17 62.77,6.17 63.38,6.17 63.99,6.17 64.6,6.17 61.24,6.71 61.85,6.71 60.64,6.71 62.46,6.71 63.07,6.71 63.68,6.71 64.29,6.71 60.94,7.24 61.55,7.24 60.33,7.24 62.16,7.24 62.77,7.24 63.38,7.24 63.99,7.24 64.6,7.24 60.33,8.15 60.64,7.7 60.64,8.61 60.94,8.15 60.33,9.07 60.94,9.07 64.29,7.7 64.6,8.15 63.99,8.15 64.29,8.61 63.99,9.07 64.6,9.07 60.64,9.53 60.94,9.98 60.64,10.44 60.33,9.98 60.94,10.97 64.29,9.53 64.6,9.98 64.29,10.44 63.99,9.98 63.99,10.97 63.68,10.52 61.24,10.52 61.85,10.52 62.46,10.52 63.07,10.52 61.55,10.97 62.16,10.97 62.77,10.97 63.38,10.97 64.6,10.97 61.24,11.43 60.64,11.43 64.29,11.43 61.85,11.43 62.46,11.43 63.07,11.43 63.68,11.43
  pour Top (isolate 0.203, rank 6): 6.38,0.25 6.38,11.33 24.11,11.33 24.11,0.25
  pour Bottom (isolate 0.254, rank 6): 6.38,0.25 6.38,11.33 25.02,11.33 25.02,0.25
  pour Route2: 6.38,11.98 24.44,11.98 24.44,0.02 6.38,0.02
  pour Bottom (no thermals): 57.05,0.02 64.67,0.02 64.67,11.98 60.18,11.98 60.18,6.65 57.05,6.65
  pour Top (no thermals): 60.18,11.98 64.67,11.98 64.67,5.96 60.18,5.96
LEDG
  Top 0.152: IC7.40 11.09,6.9 10.8,7.18 10.8,7.61 R2.P$1
LEDR
  Top 0.152: 10.31,6.06 R4.P$1 10.31,6.08 10.8,6.58 11.79,6.58 11.97,6.4 IC7.41
N$2
  Bottom 0.406: D1.C 26.99,3.83 IC2.1 28.8,2.89 C23.P$1
N$4
  Top 0.406: LED4.C R4.P$2
N$6
  Top 0.152: R21.P$2 9.19,9.16 TP2.TP
N$7
  Bottom 0.406: D3.C 37.66,3.83 IC5.1 39.47,2.89 C24.P$1
N$8
  Bottom 0.406: D4.C 48.33,3.83 IC6.1 50.14,2.89 C25.P$1
N$9
  Bottom 0.152: C19.P$2 24.5,5.55 IC4.5
  Bottom 0.406: IC4.5 23.61,4.55 R29.P$1 23.8,4.12 23.36,3.68 22.84,3.68 22.37,3.21 L1.P$1
N$10
  Top 0.406: LED2.C R2.P$2
N$11
  Bottom 0.152: R29.P$2 R28.P$2 21.82,4.4 21.24,4.97 20.33,4.97 20.17,5.13 20.17,7.11 | 20.17,7.11 20.51,7.45 IC4.3 | R27.P$1 19.2,7.85 19.95,7.11 20.17,7.11
N$12
  Bottom 0.152: IC4.4 23.61,9.05 R31.P$2 24.11,8.93 R30.P$2
N$20
  Top 0.152: R24.P$2 8.92,4.22 TP3.TP
N$22
  Bottom 0.152: C3.P$1 14.23,4.56 IC1.4
N$23
  Bottom 0.406: L2.P$2 R46.P$2
N$24
  Bottom 0.406: R47.P$2 L3.P$2
N$25
  Bottom 0.406: R48.P$2 L4.P$2
N$26
  Bottom 0.406: R49.P$2 L5.P$2
N$27
  Bottom 0.406: R50.P$2 L6.P$2
N$28
  Bottom 0.406: R51.P$2 L7.P$2
N$29  (via drill 0.3)
  Top 0.406: Q1.4 50.22,0.86 v51.57,0.86
  Bottom 0.406: v51.57,0.86 55.84,0.86 56.26,1.28 R46.P$1
N$30  (via drill 0.3)
  Top 0.406: v54.39,10.23 55.66,10.23 Q2.4
  Bottom 0.406: R47.P$1 55.03,10.23 v54.39,10.23
N$31  (via drill 0.3)
  Top 0.406: Q3.4 39.55,0.86 v40.9,0.86
  Bottom 0.406: v40.9,0.86 45.17,0.86 45.59,1.28 R48.P$1
N$32  (via drill 0.3)
  Top 0.406: v43.72,10.23 44.99,10.23 Q4.4
  Bottom 0.406: R49.P$1 44.36,10.23 v43.72,10.23
N$34  (via drill 0.3)
  Top 0.406: Q5.4 28.88,0.86 v30.23,0.86
  Bottom 0.406: v30.23,0.86 34.58,0.86 34.92,1.21 R50.P$1
N$35  (via drill 0.3)
  Top 0.406: v33.05,10.23 34.33,10.23 Q6.4
  Bottom 0.406: R51.P$1 33.69,10.23 v33.05,10.23
PGND  (via drill 0.3)
  Route2 0.152: 57.51,11.53 16.52,11.53 v16.13,11.15
  Bottom 0.152: v16.13,11.15 17.05,11.15 17.35,10.84 17.35,8.56 17.96,7.95 R27.P$2
  Bottom 0.406: C32.P$2 51.2,9.82 v51.64,9.37 | C27.P$2 40.53,9.82 v40.98,9.37 | C26.P$2 29.86,9.82 v30.31,9.37
  other vias: 53.55,8 53.93,7.54 52.79,7.09 52.41,6.63 52.02,6.17 54.31,8 53.55,7.09 53.17,6.63 52.79,6.17 52.02,7.09 54.31,7.09 53.93,6.63 53.55,6.17 52.41,7.54 54.31,6.17 53.17,7.54 52.79,8 52.02,8 59.64,7.16 59.04,7.16 57.21,8.08 57.51,8.53 59.64,8.08 58.43,8.08 58.12,10.97 58.43,10.52 59.04,10.52 58.12,8.53 59.64,10.52 59.34,10.06 58.12,10.06 59.34,7.62 58.12,7.62 57.82,7.16 57.82,8.08 57.21,8.99 57.51,10.06 57.51,7.62 57.21,7.16 58.73,8.53 59.04,8.08 58.73,7.62 58.43,7.16 57.21,9.6 57.82,10.52 58.73,10.06 59.34,8.53 59.64,8.99 59.64,9.6 58.73,10.97 59.34,10.97 57.51,10.97 57.21,10.52 53.17,8.46 53.93,8.46 52.41,8.46 51.64,8.46 53.55,8.92 54.31,8.92 52.79,8.92 52.02,8.92 53.17,9.37 53.93,9.37 52.41,9.37 53.55,9.83 52.79,9.83 52.02,9.83 53.17,10.29 52.41,10.29 51.64,10.29 42.88,8 43.26,7.54 42.12,7.09 41.74,6.63 41.36,6.17 43.64,8 42.88,7.09 42.5,6.63 42.12,6.17 41.36,7.09 43.64,7.09 43.26,6.63 42.88,6.17 41.74,7.54 43.64,6.17 42.5,7.54 42.12,8 41.36,8 42.5,8.46 43.26,8.46 41.74,8.46 40.98,8.46 42.88,8.92 43.64,8.92 42.12,8.92 41.36,8.92 42.5,9.37 43.26,9.37 41.74,9.37 42.88,9.83 42.12,9.83 41.36,9.83 42.5,10.29 41.74,10.29 40.98,10.29 32.21,8 32.59,7.54 31.45,7.09 31.07,6.63 30.69,6.17 32.97,8 32.21,7.09 31.83,6.63 31.45,6.17 30.69,7.09 32.97,7.09 32.59,6.63 32.21,6.17 31.07,7.54 32.97,6.17 31.83,7.54 31.45,8 30.69,8 31.83,8.46 32.59,8.46 31.07,8.46 30.31,8.46 32.21,8.92 32.97,8.92 31.45,8.92 30.69,8.92 31.83,9.37 32.59,9.37 31.07,9.37 32.21,9.83 31.45,9.83 30.69,9.83 31.83,10.29 31.07,10.29 30.31,10.29
  pour Route2: 25.13,11.96 56.22,11.96 57.51,11.96 59.49,11.96 59.49,5.71 25.13,5.71
  pour Route15: 25.13,11.96 59.8,11.89 59.8,5.71 25.13,5.71
  pour Top (no thermals): 40.78,11.22 45.96,11.22 45.93,5.74 40.75,5.74
  pour Bottom: 51.42,11.98 54.69,11.98 54.69,7.41 56.6,7.41 56.6,5.96 51.42,5.96
  pour Top (no thermals): 30.11,11.22 35.3,11.22 35.26,5.74 30.08,5.74
  pour Bottom: 30.08,11.98 33.36,11.98 33.36,7.41 35.26,7.41 35.26,5.96 30.08,5.96
  pour Bottom: 40.75,11.98 44.02,11.98 44.02,7.41 45.93,7.41 45.93,5.96 40.75,5.96
  pour Top (no thermals): 51.45,11.98 59.8,11.98 59.8,5.96 51.42,5.96
  pour Bottom (no thermals): 57.05,7.03 59.8,7.03 59.83,11.22 57.09,11.22
PHASE_U  (via drill 0.3)
  Bottom 0.406: IC2.7 34,5.51 31.3,5.51 30.08,4.29 30.08,1.93 29.25,1.1 C23.P$2 28.85,0.86 v27.49,0.86 | R14.P$1 27.41,9.74 v27.41,10.23
  pour Top (no thermals): 25.13,12.06 29.62,12.06 29.66,0.02 25.13,0.02
PHASE_V  (via drill 0.3)
  Bottom 0.406: v38.08,0.94 38.24,1.1 C24.P$2 39.92,1.1 40.75,1.93 40.75,4.29 41.97,5.51 44.66,5.51 IC5.7 | R16.P$1 38.08,9.74 v38.08,10.23
  pour Top (no thermals): 35.79,11.98 40.29,11.98 40.29,0.02 35.79,0.02
PHASE_W  (via drill 0.3)
  Bottom 0.406: IC6.7 55.33,5.51 52.63,5.51 51.41,4.29 51.41,1.93 50.59,1.1 C25.P$2 48.91,1.1 v48.75,0.94 | R18.P$1 48.75,9.74 v48.75,10.23
  pour Top (no thermals): 46.46,11.98 50.96,11.98 50.99,0.02 46.46,0.02
RST  (via drill 0.3)
  Top 0.152: v16.06,3.98 16.44,3.98 17.06,3.36 IC7.7
  Bottom 0.152: C6.P$2 14.76,1.54 15.37,2.15 15.68,2.15 15.96,2.43 15.96,3.88 v16.06,3.98
RXD  (via drill 0.3)
  Top 0.152: v11.28,7.39 11.28,8.19 R21.P$1 | IC7.43 11.98,5.4 11.64,5.74 v11.33,5.74
  Bottom 0.152: v11.33,5.74 11.64,6.04 11.64,7.03 v11.28,7.39
TCK/SWCLK  (via drill 0.3)
  Top 0.152: TP12.TP 10.72,10.31 12.56,8.47 IC7.37
  other vias: 10.72,10.84
TDO/TRACESWO  (via drill 0.3)
  Top 0.152: IC7.39 11.96,7.4 11.66,7.69 11.66,8.91 10.72,9.85 10.34,9.85 TP13.TP
  other vias: 9.35,10.84
TMS/SWDIO  (via drill 0.3)
  Top 0.152: IC7.34 15.06,10.7 14.46,11.3 12.55,11.3 TP11.TP
  other vias: 12.1,10.84
TXD
  Top 0.152: R24.P$1 10.8,4.32 10.8,6.04 11.03,6.27 11.56,6.27 11.94,5.89 IC7.42
U_!DIS  (via drill 0.3)
  Top 0.152: IC7.26 19.06,8.98 v19.26,8.78
  Bottom 0.152: v19.26,8.78 19.26,10.23 20.02,10.99 28.02,10.99 28.4,10.61 R8.P$1
U_!DIS!1
  Bottom 0.152: IC2.3 26.17,6.37 25.81,6.73 25.81,7.9 26.01,8.1 27.68,8.1 28.25,8.66 R8.P$2
U_GATE_HIGH
  Bottom 0.406: L6.P$1 34.92,3.31 IC2.8
U_GATE_LOW
  Bottom 0.406: IC2.5 33.92,8.12 L7.P$1
U_PWM  (via drill 0.3)
  Top 0.152: IC7.29 17.56,10.52 18.04,10.99 24.59,10.99 v25.36,10.23
  Bottom 0.152: v25.36,10.23 25.51,10.08 25.51,5.58 R5.P$2
U_PWM1
  Bottom 0.152: IC2.2 26.24,5.1 25.11,3.97 R5.P$1
U_VOLTAGE  (via drill 0.3)
  Top 0.152: IC7.10 18.56,2.35 v18.64,2.42
  Route15 0.152: v26.73,10.23 26.73,10.31 26.04,10.99 25.28,10.99 24.75,10.46 v24.75,0.78
  Bottom 0.152: R14.P$2 26.73,8.66 | 26.73,8.66 R15.P$1 | v26.73,10.23 26.73,8.66 | v18.64,2.42 18.64,1.48 19.49,0.63 24.59,0.63 v24.75,0.78
USART_+5V
  Top 0.406: D2.A 8.05,0.87 TP4.TP
V_!DIS  (via drill 0.3)
  Top 0.152: IC7.27 18.56,8.8 v18.57,8.78
  Bottom 0.152: v18.57,8.78 18.57,10.23 19.64,11.3 38.61,11.3 39.07,10.84 R9.P$1
V_!DIS!1
  Bottom 0.152: IC5.3 36.84,6.37 36.48,6.73 36.48,7.87 36.71,8.1 38.35,8.1 38.92,8.66 R9.P$2
V_BATT  (via drill 0.3)
  Top 0.152: IC7.13 21.06,2.18 v21.39,1.85
  Bottom 0.152: 27.38,2.45 27.21,2.28 25.99,2.28 25.74,2.54 22.92,2.54 22.76,2.38 21.93,2.38 v21.39,1.85
  Bottom 0.406: R13.P$2 27.38,2.45 R12.P$1
V_GATE_HIGH
  Bottom 0.406: IC5.8 45.59,3.31 L4.P$1
V_GATE_LOW
  Bottom 0.406: IC5.5 44.59,8.12 L5.P$1
V_IN  (via drill 0.3)
  Top 0.406: D2.C v10.04,1.62
  Route15 0.406: v15.68,6.27 v15.68,5.66 v15.68,5.05 15.45,4.82 15.45,2.61 | v10.04,1.62 10.42,1.24 12.71,1.24 13.09,1.62 14.46,1.62 15.45,2.61 | v22.92,1.85 22.23,1.16 16.9,1.16 15.45,2.61
  Bottom 0.406: C2.P$1 17.17,6.8 IC1.1 16.02,6.61 v15.68,6.27 v15.68,5.66 v15.68,5.05 16.02,4.71 IC1.3 17.24,4.45 C1.+ | J3.P$1 24.38,2.08 23.22,2.08 22.99,1.85 v22.92,1.85 | TP8.TP v10.04,1.62
V_PWM  (via drill 0.3)
  Top 0.152: IC7.30 17.06,10.47 17.89,11.3 35.19,11.3 35.95,10.54 v35.95,10.23
  Bottom 0.152: R6.P$2 35.95,2.8 v35.95,10.23
V_PWM1
  Bottom 0.152: R6.P$1 36.48,3.27 36.48,4.75 36.84,5.1 IC5.2
V_VOLTAGE  (via drill 0.3)
  Top 0.152: IC7.11 19.06,2.19 v19.3,2.42
  Route15 0.152: v37.39,10.23 37.39,10.31 36.4,11.3 25.13,11.3 24.44,10.61 24.44,1.47 v24.14,1.16
  Bottom 0.152: R16.P$2 37.39,9.28 | 37.39,9.28 v37.39,10.23 | R17.P$1 37.39,9.28 | v19.3,2.42 19.3,1.43 19.79,0.94 23.91,0.94 v24.14,1.16
VDDA  (via drill 0.3)
  Top 0.305: IC7.9 18.06,2.74 18.46,3.15 v18.88,3.15
  Bottom 0.305: v18.88,3.15 18.46,3.15 18.03,2.71 L8.P$1
  Bottom 0.406: C7.P$1 18.88,3.71 | 18.88,3.71 C8.P$1 | v18.88,3.15 18.88,3.71
W_!DIS  (via drill 0.3)
  Top 0.152: IC7.28 18.06,8.96 v17.89,8.78
  Bottom 0.152: v17.89,8.78 17.89,10.23 19.26,11.6 49.13,11.6 49.74,10.99 R10.P$1
W_!DIS1
  Bottom 0.152: IC6.3 47.5,6.37 47.15,6.73 47.15,7.9 47.34,8.1 49.02,8.1 49.59,8.66 R10.P$2
W_GATE_HIGH
  Bottom 0.406: L2.P$1 56.26,3.31 IC6.8
W_GATE_LOW
  Bottom 0.406: IC6.5 55.26,8.12 L3.P$1
W_PWM  (via drill 0.3)
  Top 0.152: IC7.31 16.56,10.51 17.66,11.6 45.55,11.6 46.69,10.46 v46.69,10.23
  Bottom 0.152: R7.P$2 46.69,2.8 v46.69,10.23
W_PWM1
  Bottom 0.152: R7.P$1 47.15,3.34 47.15,4.75 47.5,5.1 IC6.2
W_VOLTAGE  (via drill 0.3)
  Top 0.152: IC7.12 19.56,1.92 v20.06,2.42
  Route15 0.152: v48.06,10.23 48.06,10.31 46.77,11.6 24.97,11.6 24.14,10.77 24.14,2.08 v23.53,1.47
  Bottom 0.152: R18.P$2 48.06,9.28 | 48.06,9.28 v48.06,10.23 | R22.P$1 48.06,9.28 | v20.06,2.42 20.06,1.43 20.25,1.24 23.3,1.24 v23.53,1.47

### Text on the board
tPlace: STRIP | CCBYSA | + | V0.1 | OBLDC | U | V | W
bPlace: J2 | J1 | - | STRIP | OBLDC | J3 | CCBYSA | C12PET